# Altium schematic sheet Connector.SchDoc: Ravage - Connectors
size A4; Address1: Drawn By:; Address2: Dan Visser; DocumentNumber: A; Revision: 0.1-alpha; SheetNumber: 16; SheetTotal: 16
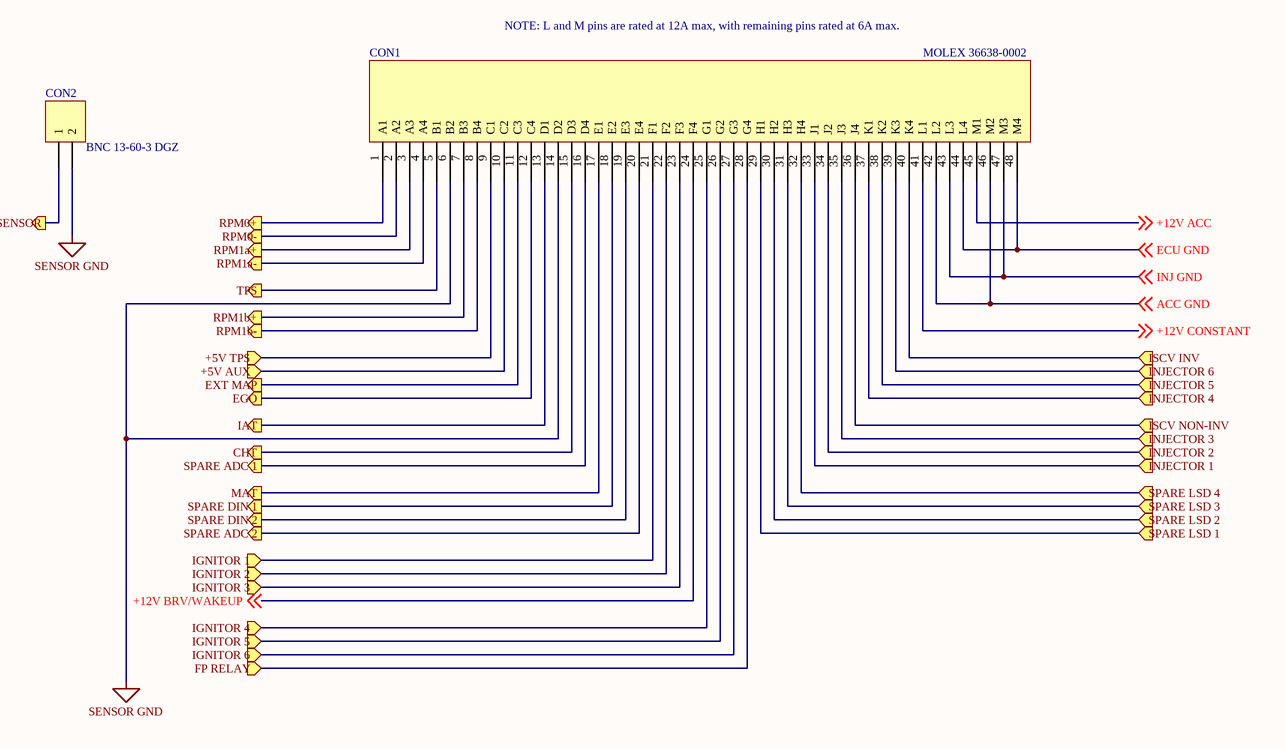
[diagram p0: Connector.SchDoc]

## Parts
CON1  MOLEX 36638-0002
CON2  BNC 13-60-3 DGZ  [HDR1X2]

## Ports
+5V AUX (in), +5V TPS (in), CHT (out), EGO (out), EXT MAP (out), FP RELAY (in), IAT (out), IGNITOR 1 (in), IGNITOR 2 (in), IGNITOR 3 (in), IGNITOR 4 (in), IGNITOR 5 (in), IGNITOR 6 (in), INJECTOR 1 (in), INJECTOR 2 (in), INJECTOR 3 (in), INJECTOR 4 (in), INJECTOR 5 (in), INJECTOR 6 (in), ISCV INV (in), ISCV NON-INV (in), KNOCK SENSOR (out), MAT (out), RPM0+ (out), RPM0- (out), RPM1a+ (out), RPM1a- (out), RPM1b+ (out), RPM1b- (out), SPARE ADC 1 (out), SPARE ADC 2 (out), SPARE DIN 1 (out), SPARE DIN 2 (out), SPARE LSD 1 (in), SPARE LSD 2 (in), SPARE LSD 3 (in), SPARE LSD 4 (in), TPS (out)

## Nets
SENSOR GND: CON1.6(B2) CON1.14(D2) CON2.2
+5V AUX: CON1.10(C2) ; port +5V AUX
+5V TPS: CON1.9(C1) ; port +5V TPS
+12V ACC: CON1.45(M1) ; off-sheet +12V ACC
+12V BRV/WAKEUP: CON1.24(F4) ; off-sheet +12V BRV/WAKEUP
+12V CONSTANT: CON1.41(L1) ; off-sheet +12V CONSTANT
ACC GND: CON1.42(L2) CON1.46(M2) ; off-sheet ACC GND
CHT: CON1.15(D3) ; port CHT
ECU GND: CON1.44(L4) CON1.48(M4) ; off-sheet ECU GND
EGO: CON1.12(C4) ; port EGO
EXT MAP: CON1.11(C3) ; port EXT MAP
FP RELAY: CON1.28(G4) ; port FP RELAY
IAT: CON1.13(D1) ; port IAT
IGNITOR 1: CON1.21(F1) ; port IGNITOR 1
IGNITOR 2: CON1.22(F2) ; port IGNITOR 2
IGNITOR 3: CON1.23(F3) ; port IGNITOR 3
IGNITOR 4: CON1.25(G1) ; port IGNITOR 4
IGNITOR 5: CON1.26(G2) ; port IGNITOR 5
IGNITOR 6: CON1.27(G3) ; port IGNITOR 6
INJ GND: CON1.43(L3) CON1.47(M3) ; off-sheet INJ GND
INJECTOR 1: CON1.33(J1) ; port INJECTOR 1
INJECTOR 2: CON1.34(J2) ; port INJECTOR 2
INJECTOR 3: CON1.35(J3) ; port INJECTOR 3
INJECTOR 4: CON1.37(K1) ; port INJECTOR 4
INJECTOR 5: CON1.38(K2) ; port INJECTOR 5
INJECTOR 6: CON1.39(K3) ; port INJECTOR 6
ISCV INV: CON1.40(K4) ; port ISCV INV
ISCV NON-INV: CON1.36(J4) ; port ISCV NON-INV
KNOCK SENSOR: CON2.1 ; port KNOCK SENSOR
MAT: CON1.17(E1) ; port MAT
RPM0+: CON1.1(A1) ; port RPM0+
RPM0-: CON1.2(A2) ; port RPM0-
RPM1a+: CON1.3(A3) ; port RPM1a+
RPM1a-: CON1.4(A4) ; port RPM1a-
RPM1b+: CON1.7(B3) ; port RPM1b+
RPM1b-: CON1.8(B4) ; port RPM1b-
SPARE ADC 1: CON1.16(D4) ; port SPARE ADC 1
SPARE ADC 2: CON1.20(E4) ; port SPARE ADC 2
SPARE DIN 1: CON1.18(E2) ; port SPARE DIN 1
SPARE DIN 2: CON1.19(E3) ; port SPARE DIN 2
SPARE LSD 1: CON1.29(H1) ; port SPARE LSD 1
SPARE LSD 2: CON1.30(H2) ; port SPARE LSD 2
SPARE LSD 3: CON1.31(H3) ; port SPARE LSD 3
SPARE LSD 4: CON1.32(H4) ; port SPARE LSD 4
TPS: CON1.5(B1) ; port TPS

## Notes on the sheet
- NOTE: L and M pins are rated at 12A max, with remaining pins rated at 6A max.
- Title
- Size:
- Date:
- A4
- Number:
- Time:
- Revision:
- Sheet
- of

## Library data of the parts
CON2 = Header 2: Header, 2-Pin; LatestRevisionDate: 17-Jul-2002; LatestRevisionNote: Re-released for DXP Platform.; Publisher: Altium Limited